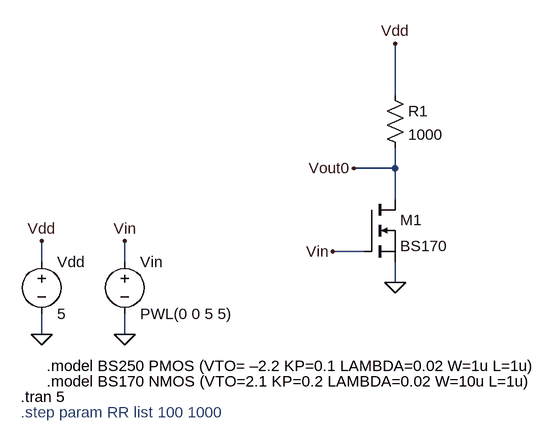
[diagram p0: schematic Draft52.asc]
Draft52.asc, the LTspice schematic file:
Version 4
SHEET 1 992 680
WIRE 464 -128 464 -208
WIRE 464 -16 464 -48
WIRE 464 -16 400 -16
WIRE 464 32 464 -16
WIRE 416 112 368 112
WIRE -80 128 -80 96
WIRE 48 128 48 96
WIRE 464 160 464 128
WIRE -80 240 -80 208
WIRE 48 240 48 208
FLAG -80 240 0
FLAG 48 240 0
FLAG -80 96 Vdd
FLAG 48 96 Vin
FLAG 464 -208 Vdd
FLAG 368 112 Vin
FLAG 464 160 0
FLAG 400 -16 Vout0
SYMBOL voltage -80 112 R0
WINDOW 123 0 0 Left 0
WINDOW 39 0 0 Left 0
SYMATTR InstName Vdd
SYMATTR Value 5
SYMBOL voltage 48 112 R0
WINDOW 123 0 0 Left 0
WINDOW 39 0 0 Left 0
SYMATTR InstName Vin
SYMATTR Value PWL(0 0 5 5)
SYMBOL nmos 416 32 R0
SYMATTR InstName M1
SYMATTR Value BS170
SYMBOL res 448 -144 R0
SYMATTR InstName R1
SYMATTR Value 1000
TEXT -72 312 Left 2 !.model BS170 NMOS (VTO=2.1 KP=0.2 LAMBDA=0.02 W=10u L=1u)
TEXT -112 336 Left 2 !.tran 5
TEXT -112 360 Left 2 ;.step param RR list 100 1000
TEXT -72 288 Left 2 !.model BS250 PMOS (VTO= ‒2.2 KP=0.1 LAMBDA=0.02 W=1u L=1u)

The netlist it stands for:
* Draft52.asc
Vdd Vdd 0 5
Vin Vin 0 PWL(0 0 5 5)
M1 Vout0 Vin 0 0 BS170
R1 Vdd Vout0 1000
.model NMOS NMOS
.model PMOS PMOS
.lib standard.mos
.model BS170 NMOS (VTO=2.1 KP=0.2 LAMBDA=0.02 W=10u L=1u)
.tran 5
* .step param RR list 100 1000
.model BS250 PMOS (VTO= ‒2.2 KP=0.1 LAMBDA=0.02 W=1u L=1u)
.backanno
.end